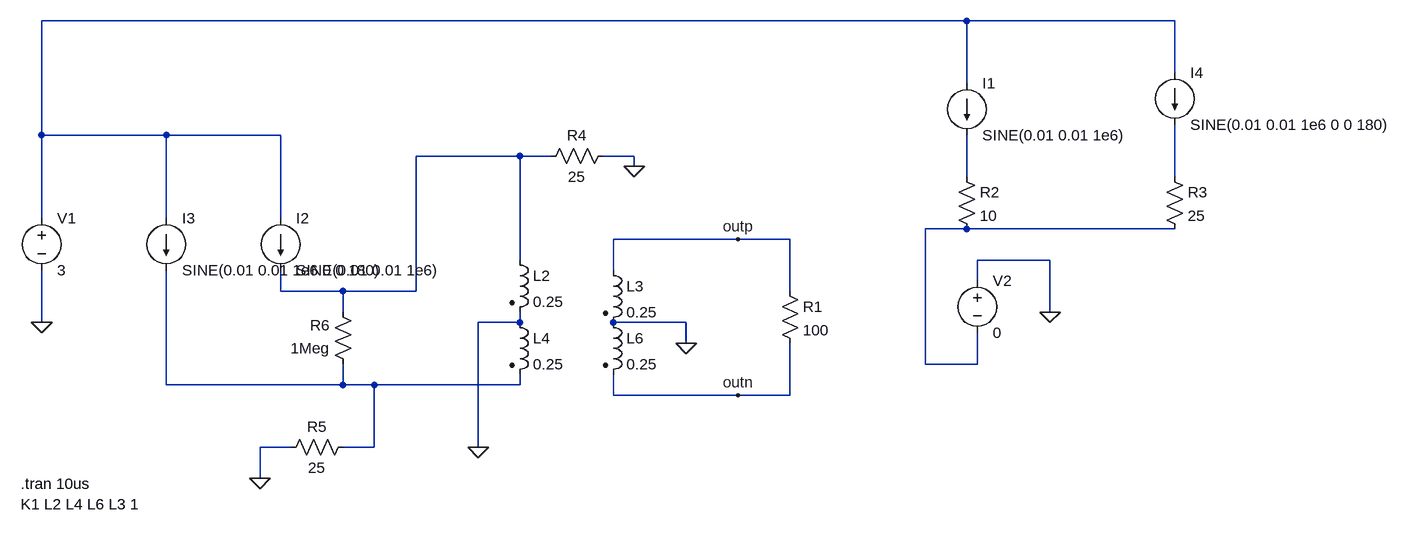
[diagram p0: schematic dac_transfer_function.asc]
dac_transfer_function.asc, the LTspice schematic file:
Version 4
SHEET 1 1720 680
WIRE 1072 -256 -352 -256
WIRE 1392 -256 1072 -256
WIRE 1392 -176 1392 -256
WIRE 1072 -160 1072 -256
WIRE -352 -80 -352 -256
WIRE -160 -80 -352 -80
WIRE 16 -80 -160 -80
WIRE 384 -48 224 -48
WIRE 432 -48 384 -48
WIRE 560 -48 512 -48
WIRE 560 -32 560 -48
WIRE 1072 -16 1072 -80
WIRE 1392 -16 1392 -96
WIRE -352 48 -352 -80
WIRE -160 48 -160 -80
WIRE 16 48 16 -80
WIRE 1072 64 1008 64
WIRE 1392 64 1072 64
WIRE 720 80 528 80
WIRE 800 80 720 80
WIRE 384 112 384 -48
WIRE 1200 112 1088 112
WIRE 528 128 528 80
WIRE 1088 144 1088 112
WIRE 16 160 16 128
WIRE 112 160 16 160
WIRE 224 160 224 -48
WIRE 224 160 112 160
WIRE 800 160 800 80
WIRE 112 192 112 160
WIRE 1200 192 1200 112
WIRE -352 208 -352 128
WIRE 384 208 384 192
WIRE 384 208 320 208
WIRE 640 208 528 208
WIRE 640 240 640 208
WIRE 1008 272 1008 64
WIRE 1088 272 1088 224
WIRE 1088 272 1008 272
WIRE -160 304 -160 128
WIRE 112 304 112 272
WIRE 112 304 -160 304
WIRE 160 304 112 304
WIRE 384 304 384 288
WIRE 384 304 160 304
WIRE 528 320 528 288
WIRE 720 320 528 320
WIRE 800 320 800 240
WIRE 800 320 720 320
WIRE 32 400 -16 400
WIRE 160 400 160 304
WIRE 160 400 112 400
WIRE 320 400 320 208
WIRE -16 448 -16 400
FLAG -352 208 0
FLAG 1200 192 0
FLAG -16 448 0
FLAG 560 -32 0
FLAG 640 240 0
FLAG 320 400 0
FLAG 720 80 outp
FLAG 720 320 outn
SYMBOL current 16 48 R0
WINDOW 123 0 0 Left 2
WINDOW 39 0 0 Left 2
SYMATTR InstName I2
SYMATTR Value SINE(0.01 0.01 1e6)
SYMBOL ind2 368 96 R0
SYMATTR InstName L2
SYMATTR Value 0.25
SYMATTR Type ind
SYMBOL ind2 368 192 R0
SYMATTR InstName L4
SYMATTR Value 0.25
SYMATTR Type ind
SYMBOL res 784 144 R0
SYMATTR InstName R1
SYMATTR Value 100
SYMBOL current -160 48 R0
WINDOW 123 0 0 Left 2
WINDOW 39 0 0 Left 2
SYMATTR InstName I3
SYMATTR Value SINE(0.01 0.01 1e6 0 0 180)
SYMBOL voltage -352 32 R0
WINDOW 123 0 0 Left 2
WINDOW 39 0 0 Left 2
SYMATTR InstName V1
SYMATTR Value 3
SYMBOL res 1056 -32 R0
SYMATTR InstName R2
SYMATTR Value 10
SYMBOL current 1072 -160 R0
WINDOW 123 0 0 Left 2
WINDOW 39 0 0 Left 2
SYMATTR InstName I1
SYMATTR Value SINE(0.01 0.01 1e6)
SYMBOL voltage 1088 128 R0
WINDOW 123 0 0 Left 2
WINDOW 39 0 0 Left 2
SYMATTR InstName V2
SYMATTR Value 0
SYMBOL current 1392 -176 R0
WINDOW 123 0 0 Left 2
WINDOW 39 0 0 Left 2
SYMATTR InstName I4
SYMATTR Value SINE(0.01 0.01 1e6 0 0 180)
SYMBOL res 1376 -32 R0
SYMATTR InstName R3
SYMATTR Value 25
SYMBOL res 528 -64 R90
WINDOW 0 0 56 VBottom 2
WINDOW 3 32 56 VTop 2
SYMATTR InstName R4
SYMATTR Value 25
SYMBOL res 128 384 R90
WINDOW 0 0 56 VBottom 2
WINDOW 3 32 56 VTop 2
SYMATTR InstName R5
SYMATTR Value 25
SYMBOL res 128 288 R180
WINDOW 0 36 76 Left 2
WINDOW 3 36 40 Left 2
SYMATTR InstName R6
SYMATTR Value 1Meg
SYMBOL ind2 512 112 R0
SYMATTR InstName L3
SYMATTR Value 0.25
SYMATTR Type ind
SYMBOL ind2 512 192 R0
SYMATTR InstName L6
SYMATTR Value 0.25
SYMATTR Type ind
TEXT -384 488 Left 2 !K1 L2 L4 L6 L3 1
TEXT -384 456 Left 2 !.tran 10us

The netlist it stands for:
* dac_transfer_function.asc
I2 N001 N002 SINE(0.01 0.01 1e6)
L2 N002 0 0.25
L4 0 N006 0.25
R1 outp outn 100
I3 N001 N006 SINE(0.01 0.01 1e6 0 0 180)
V1 N001 0 3
R2 N003 N005 10
I1 N001 N003 SINE(0.01 0.01 1e6)
V2 0 N005 0
I4 N001 N004 SINE(0.01 0.01 1e6 0 0 180)
R3 N004 N005 25
R4 0 N002 25
R5 N006 0 25
R6 N006 N002 1Meg
L3 outp 0 0.25
L6 0 outn 0.25
K1 L2 L4 L6 L3 1
.tran 10us
.backanno
.end